# EAGLE design LED-strip (EAGLE 9.2.2)
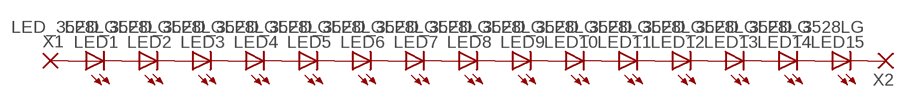
[diagram p0: schematic, sheet 1]

## Parts
LED1  LED_3528LG  [LED2835_LG]
LED2  LED_3528LG  [LED2835_LG]
LED3  LED_3528LG  [LED2835_LG]
LED4  LED_3528LG  [LED2835_LG]
LED5  LED_3528LG  [LED2835_LG]
LED6  LED_3528LG  [LED2835_LG]
LED7  LED_3528LG  [LED2835_LG]
LED8  LED_3528LG  [LED2835_LG]
LED9  LED_3528LG  [LED2835_LG]
LED10  LED_3528LG  [LED2835_LG]
LED11  LED_3528LG  [LED2835_LG]
LED12  LED_3528LG  [LED2835_LG]
LED13  LED_3528LG  [LED2835_LG]
LED14  LED_3528LG  [LED2835_LG]
LED15  LED_3528LG  [LED2835_LG]
X1  WIREPAD-SMD2  [PAD-1.27X2.54]
X2  WIREPAD-SMD2  [PAD-1.27X2.54]

## Nets
N$1: LED1.A X1.P$1(P)
N$2: LED1.C LED2.A
N$3: LED2.C LED3.A
N$4: LED3.C LED4.A
N$5: LED4.C LED5.A
N$6: LED5.C LED6.A
N$7: LED6.C LED7.A
N$8: LED7.C LED8.A
N$9: LED8.C LED9.A
N$10: LED9.C LED10.A
N$11: LED10.C LED11.A
N$12: LED11.C LED12.A
N$13: LED12.C LED13.A
N$14: LED13.C LED14.A
N$15: LED14.C LED15.A
N$16: LED15.C X2.P$1(P)

## Library data of the parts
LED1-LED15 = Flamberm:LED_
X1 X2 = Flamberm:WIREPAD-SMD2: SMD PAD

## Board
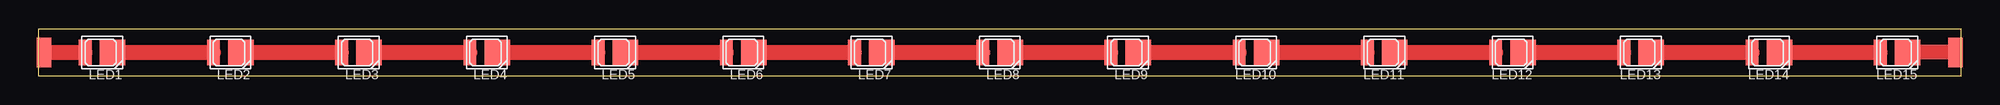
[diagram p1: board, top side]

Size 165 x 4 mm. Coordinates in mm from the lower left corner, seen from the top.
Outline: 0,0 165,0 165,4 0,4 0,0
Copper layers (1*16): Top 0.035mm / dielectric 1.5mm / Bottom 0.035mm
Design rules "EagleDesignRules": minimum track width 0.25mm, minimum drill 0.3mm, track to track 0.25mm, track to pad 0.25mm, pad to pad 0.25mm, via to via 0.25mm, smd to smd 0.25mm, copper to edge 0.5mm, drill to drill 0.5mm, minimum pad ring 10mil, minimum via ring 8mil, stop-mask expansion 4mil, vias tented up to drill 0mil, thermal gap 0.25mm

### Footprints (pad centres in the part's own frame; a part is rotated, then mirrored left to right if it is on the bottom)
LED2835_LG = smd 1.1 x 2.2: A 1.46,0 | smd 2.2 x 2.2: C -0.889,0
PAD-1.27X2.54 = smd 2.54 x 1.27: P$1 0,0

### Placement (x,y rotation side)
LED1  5.5,2 180 top
LED2  16.5,2 180 top
LED3  27.5,2 180 top
LED4  38.5,2 180 top
LED5  49.5,2 180 top
LED6  60.5,2 180 top
LED7  71.5,2 180 top
LED8  82.5,2 180 top
LED9  93.5,2 180 top
LED10  104.5,2 180 top
LED11  115.5,2 180 top
LED12  126.5,2 180 top
LED13  137.5,2 180 top
LED14  148.5,2 180 top
LED15  159.5,2 180 top
X1  0.5,2 90 top
X2  164.5,2 90 top

### Tracks (layer width: path | path; a pad name or v marks a point on that pad's centre or on a via)
N$1
  Top 1.27: X1.P$1 LED1.A
N$2
  Top 1.27: LED1.C LED2.A
N$3
  Top 1.27: LED2.C LED3.A
N$4
  Top 1.27: LED3.C LED4.A
N$5
  Top 1.27: LED4.C LED5.A
N$6
  Top 1.27: LED5.C LED6.A
N$7
  Top 1.27: LED6.C LED7.A
N$8
  Top 1.27: LED7.C LED8.A
N$9
  Top 1.27: LED8.C LED9.A
N$10
  Top 1.27: LED9.C LED10.A
N$11
  Top 1.27: LED10.C LED11.A
N$12
  Top 1.27: LED11.C LED12.A
N$13
  Top 1.27: LED12.C LED13.A
N$14
  Top 1.27: LED13.C LED14.A
N$15
  Top 1.27: LED14.C LED15.A
N$16
  Top 1.27: X2.P$1 LED15.C